# Altium schematic sheet Power.SchDoc (part 1 of 3)
size A3; SheetNumber: 3; SheetTotal: 7
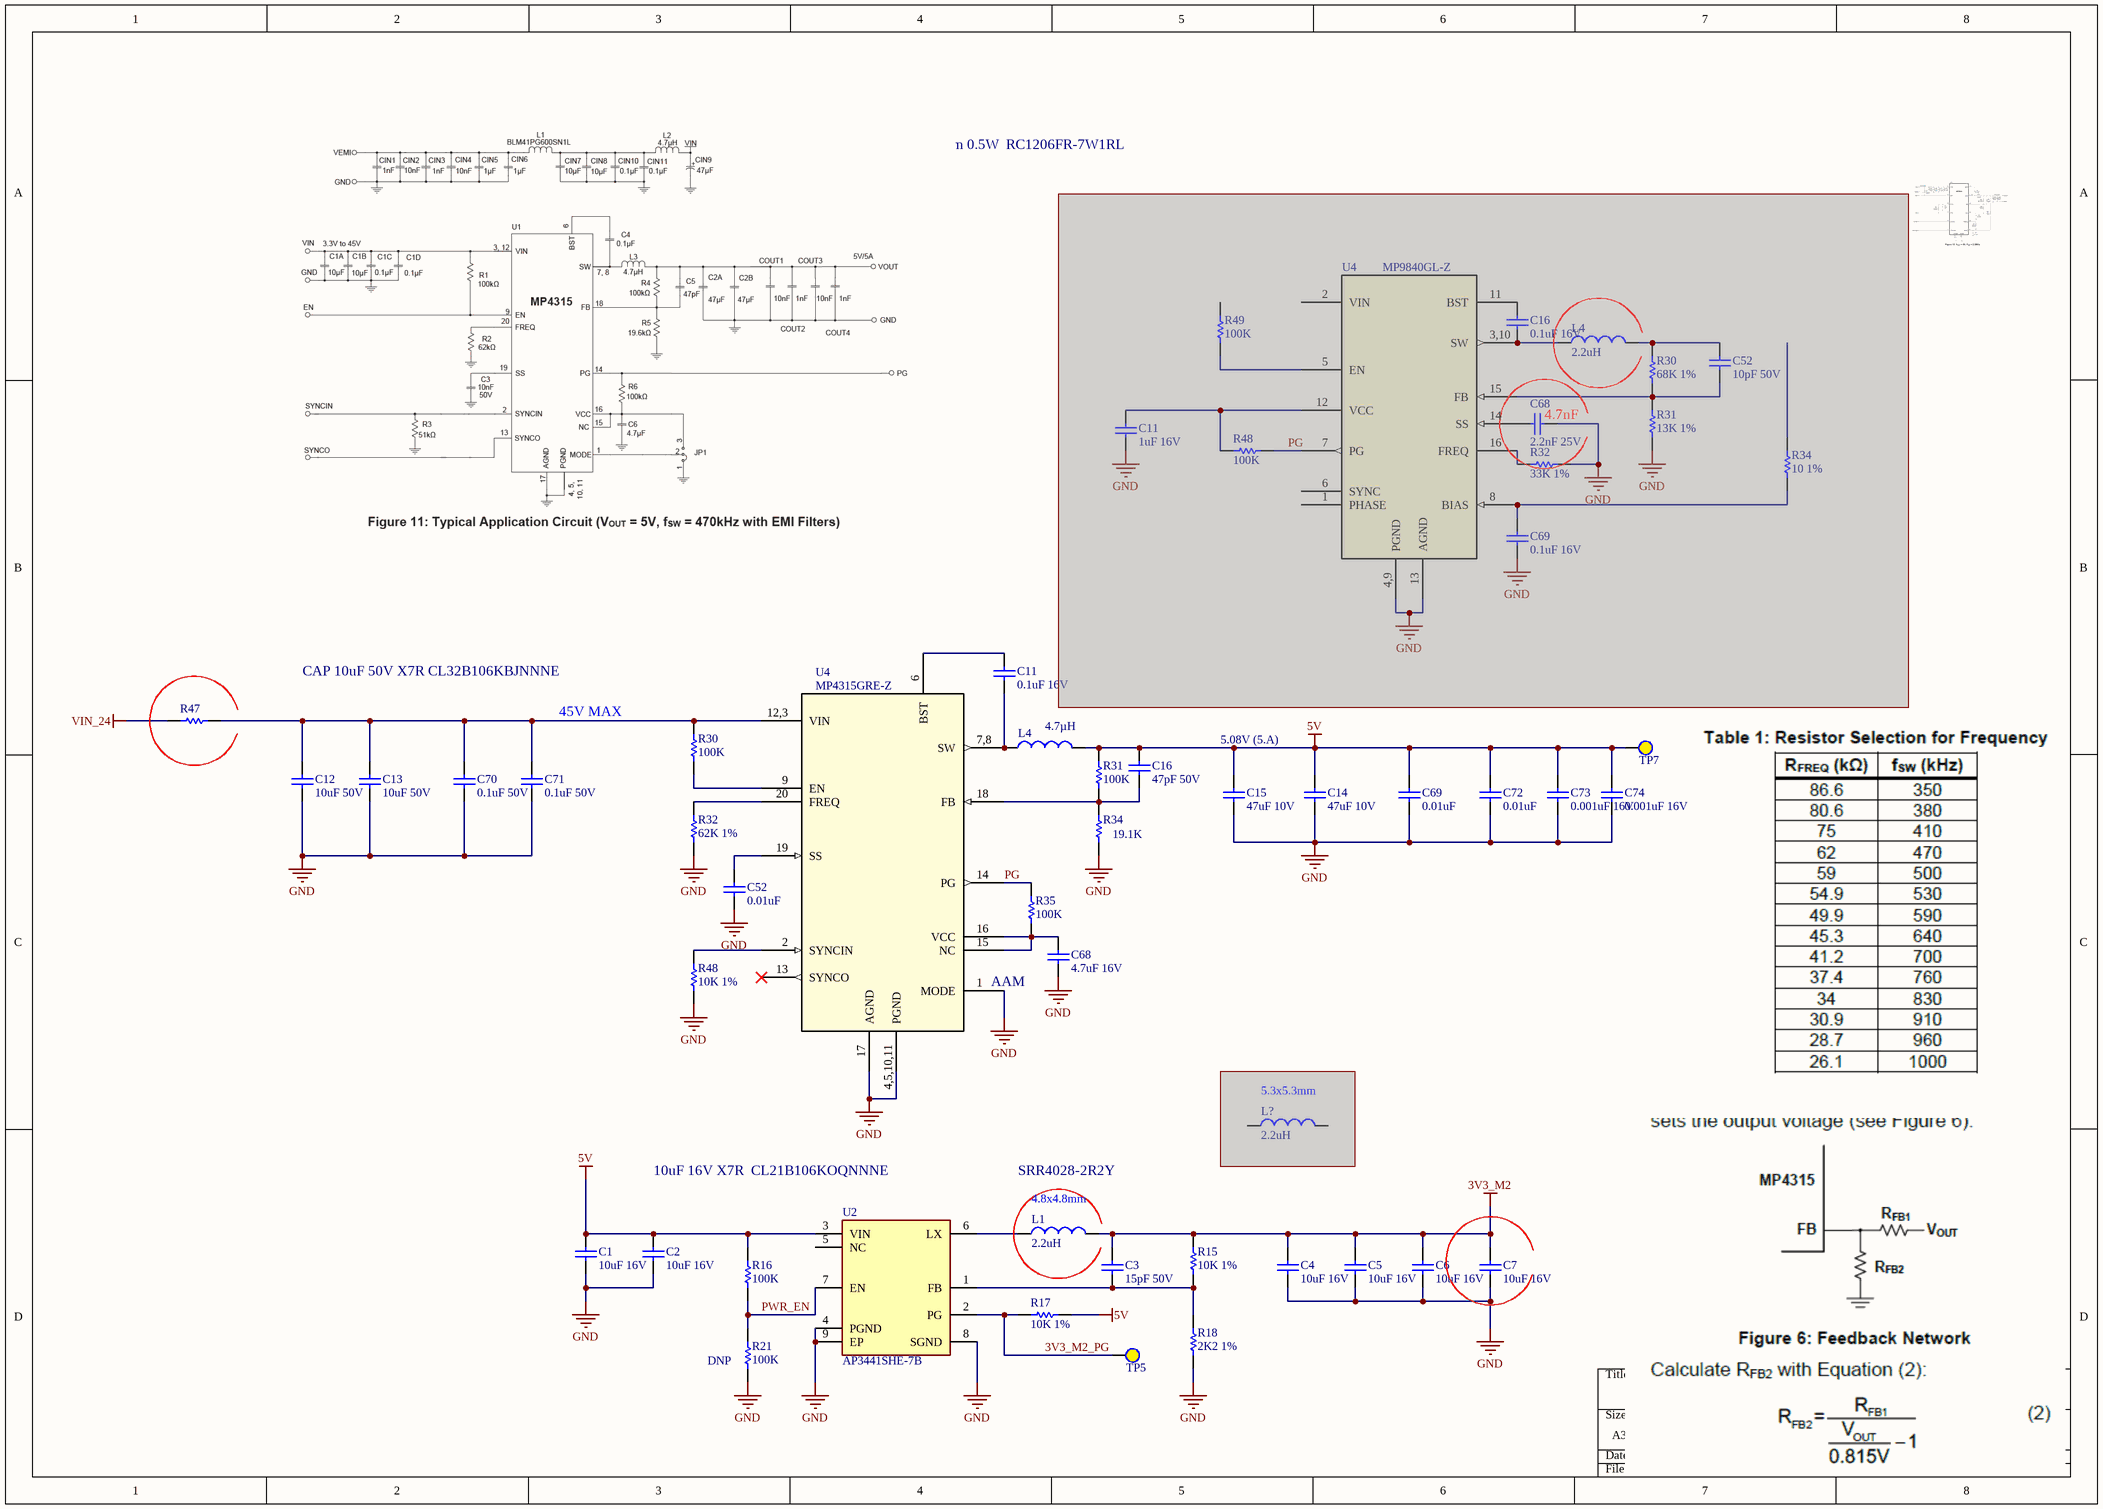
[diagram p0: Power.SchDoc]

## Parts
(Parts that share a designator on the sheet are numbered #1, #2 ... from top to bottom, then left to right.)
C1  10uF 16V  [C0805]
C2  10uF 16V  [C0805]
C3  15pF 50V  [0402]
C4  10uF 16V  [C0805]
C5  10uF 16V  [C0805]
C6  10uF 16V  [C0805]
C7  10uF 16V  [C0805]
C11#1  1uF 16V  [0402]  (masked out: inside a compile mask, not in the netlist)
C11#2  0.1uF 16V  [0402]
C12  10uF 50V  [CAPC3225X27M]
C13  10uF 50V  [CAPC3225X27M]
C14  47uF 10V  [CAPC3225X270N]
C15  47uF 10V  [CAPC3225X270N]
C16#1  0.1uF 16V  [0402]  (masked out: inside a compile mask, not in the netlist)
C16#2  47pF 50V  [0402]
C52#1  10pF 50V  [0402]  (masked out: inside a compile mask, not in the netlist)
C52#2  0.01uF  [0402]
C68#1  2.2nF 25V  [0402]  (masked out: inside a compile mask, not in the netlist)
C68#2  4.7uF 16V  [1608[0603]]
C69#1  0.1uF 16V  [0402]  (masked out: inside a compile mask, not in the netlist)
C69#2  0.01uF  [0402]
C70  0.1uF 50V  [1608[0603]]
C71  0.1uF 50V  [1608[0603]]
C72  0.01uF  [0402]
C73  0.001uF 16V  [0402]
C74  0.001uF 16V  [0402]
L1  2.2uH  [SRR4028]
L4#1  2.2uH  [74404063022]  (masked out: inside a compile mask, not in the netlist)
L4#2  value 4.7µH  [INDPM7066X310N]  (hidden comment: INDUCTOR_MGAH06034R7M-10)
L?  2.2uH  [74404063022]  (masked out: inside a compile mask, not in the netlist)
R15  10K 1%  [0402]
R16  100K  [0402]
R17  10K 1%  [0402]
R18  2K2 1%  [0402]
R21  100K  [0402]
R30#1  68K 1%  [0402]  (masked out: inside a compile mask, not in the netlist)
R30#2  100K  [0402]
R31#1  13K 1%  [0402]  (masked out: inside a compile mask, not in the netlist)
R31#2  100K  [0402]
R32#1  33K 1%  [0402]  (masked out: inside a compile mask, not in the netlist)
R32#2  62K 1%  [0402]
R34#1  10 1%  [0402]  (masked out: inside a compile mask, not in the netlist)
R34#2  19.1K  [0402]
R35  100K  [0402]
R47  Res_1206  [RESC3216X05N]  (value not drawn)
R48#1  100K  [0402]  (masked out: inside a compile mask, not in the netlist)
R48#2  10K 1%  [0402]
R49  100K  [0402]  (masked out: inside a compile mask, not in the netlist)
TP5  TESTPOINT  [TESTPOINT_0.9]  (value not drawn)  (no BOM)
TP7  TESTPOINT  [TESTPOINT_0.9]  (value not drawn)  (no BOM)
U2  AP3441SHE-7B  [SON50P201X201X60-9N-D]
U4#1  MP9840GL-Z  [MPQ4430GLZ]  (masked out: inside a compile mask, not in the netlist)
U4#2  MP4315GRE-Z  [QFN-20_MP4315_MNP]

## Nets
3V3_M2: C3.2 C4.2 C5.2 C6.2 C7.2 L1.2 R15.2
5V: C1.2 C2.2 C14.2 C15.2 C16#2.2 C69#2.2 C72.2 C73.2 C74.2 L4#2.2 R16.2 R17.2 R31#2.2 TP7.1 U2.3(VIN)
GND: C1.1 C2.1 C4.1 C5.1 C6.1 C7.1 C12.1 C13.1 C14.1 C15.1 C52#2.1 C68#2.1 C69#2.1 C70.1 C71.1 C72.1 C73.1 C74.1 R18.1 R21.1 R32#2.1 R34#2.1 R48#2.1 U2.4(PGND) U2.8(SGND) U2.9(EP) U4#2.1(MODE) U4#2.4,5,10,11(PGND) U4#2.17(AGND)
VIN_24: R47.1
3V3_M2_PG: R17.1 TP5.1 U2.2(PG)
PG: R35.2 U4#2.14(PG)
PWR_EN: R16.1 R21.2 U2.7(EN)
NetC3_1: C3.1 R15.1 R18.2 U2.1(FB)
NetC11#2_1: C11#2.1 U4#2.6(BST)
NetC11#2_2: C11#2.2 L4#2.1 U4#2.7,8(SW)
NetC12_2: C12.2 C13.2 C70.2 C71.2 R30#2.2 R47.2 U4#2.12,3(VIN)
NetC16#2_1: C16#2.1 R31#2.1 R34#2.2 U4#2.18(FB)
NetC52#2_2: C52#2.2 U4#2.19(SS)
NetC68#2_2: C68#2.2 R35.1 U4#2.15(NC) U4#2.16(VCC)
NetL1_1: L1.1 U2.6(LX)
NetR30#2_1: R30#2.1 U4#2.9(EN)
NetR32#2_2: R32#2.2 U4#2.20(FREQ)
NetR48#2_2: R48#2.2 U4#2.2(SYNCIN)

Not connected (* = marked no-connect by the designer): U2 5(NC); U4#2 13(SYNCO)*

## Notes on the sheet
- RES 1Ohm 0.5W  RC1206FR-7W1RL
- (near C68#1) 4.7nF
- CAP 10uF 50V X7R CL32B106KBJNNNE
- 45V MAX
- (near C16#2) 5.08V (5.A)
- (near U4#2) AAM
- (near L?) 5.3x5.3mm
- 10uF 16V X7R  CL21B106KOQNNNE
- SRR4028-2R2Y
- (near L1) 4.8x4.8mm
- (near R21) DNP